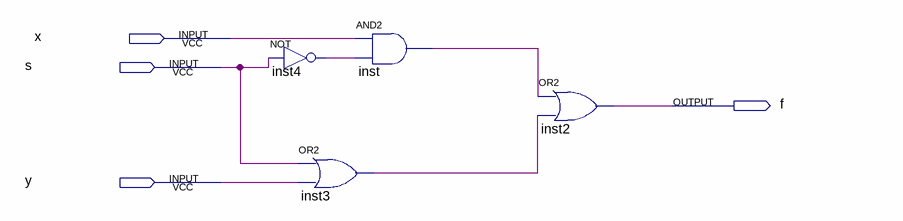
[diagram p0: schematic sheet]
// Quartus schematic Lab1schematic.bdf as structural Verilog: 4 symbols, 4 pins
module Lab1schematic (
  input  x,
  input  s,
  input  y,
  output f
);

  wire inst3_out, inst4_out, inst_out;

  not inst4 (inst4_out, s);
  and inst (inst_out, x, inst4_out);
  or inst3 (inst3_out, s, y);
  or inst2 (f, inst_out, inst3_out);
endmodule
